# Altium schematic sheet 04-USB_POWER.SchDoc
size A3
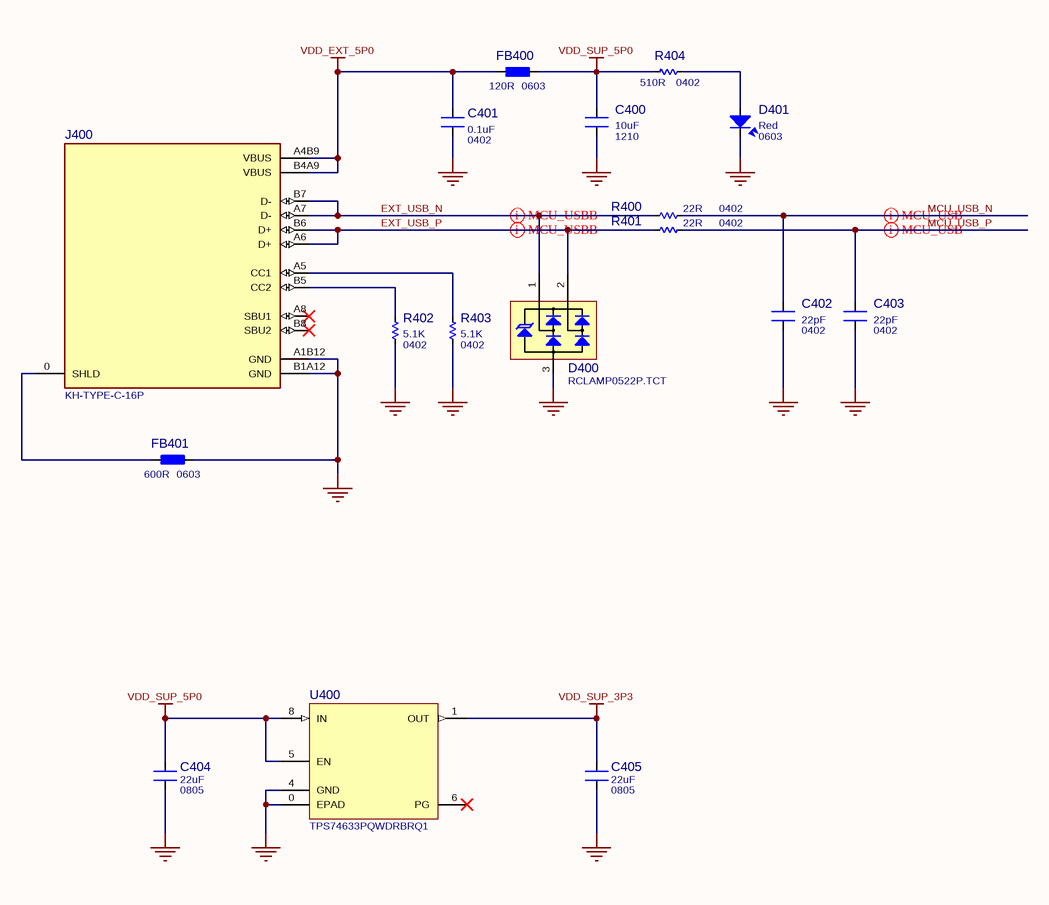
[diagram p0: 04-USB_POWER.SchDoc]

## Parts
C400  value 10uF  Package: 1210  [CAP_C_1210]  (hidden comment: Capacitor NP)
C401  value 0.1uF  Package: 0402  [CAP_C_0402]  (hidden comment: Capacitor NP)
C402  value 22pF  Package: 0402  [CAP_C_0402]  (hidden comment: Capacitor NP)
C403  value 22pF  Package: 0402  [CAP_C_0402]  (hidden comment: Capacitor NP)
C404  value 22uF  Package: 0805  [CAP_C_0805]  (hidden comment: Capacitor NP)
C405  value 22uF  Package: 0805  [CAP_C_0805]  (hidden comment: Capacitor NP)
D400  RCLAMP0522P.TCT  [SLP1610P4]
D401  Color: Red  Package: 0603  [LED-SMD-0603-RED]  (hidden comment: LED)
FB400  value 120R  Package: 0603  [IND_C_0603]  (hidden comment: Ferrite bead)
FB401  value 600R  Package: 0603  [IND_C_0603]  (hidden comment: Ferrite bead)
J400  Manufacturer Part Number: KH-TYPE-C-16P  [USB_C_F_16P_SMD]  (hidden comment: USB_C-16P)
R400  value 22R  Package: 0402  [RES_C_0402]  (hidden comment: Resistor)
R401  value 22R  Package: 0402  [RES_C_0402]  (hidden comment: Resistor)
R402  value 5.1K  Package: 0402  [RES_C_0402]  (hidden comment: Resistor)
R403  value 5.1K  Package: 0402  [RES_C_0402]  (hidden comment: Resistor)
R404  value 510R  Package: 0402  [RES_C_0402]  (hidden comment: Resistor)
U400  TPS74633PQWDRBRQ1  [SON65P300X100_HS-9N]

## Nets
GND: C400.1 C401.1 C402.2 C403.2 C404.1 C405.1 D400.3(GND) D401.2 FB401.1 J400.A1B12(GND) J400.B1A12(GND) R402.2 R403.2 U400.0(EPAD) U400.4(GND)
VDD_EXT_5P0: C401.2 FB400.2 J400.A4B9(VBUS) J400.B4A9(VBUS)
VDD_SUP_3P3: C405.2 U400.1(OUT)
VDD_SUP_5P0: C400.2 C404.2 FB400.1 R404.1 U400.5(EN) U400.8(IN)
EXT_USB_N: D400.1(DM) J400.A7(D-) J400.B7(D-) R400.1
EXT_USB_P: D400.2(DP) J400.A6(D+) J400.B6(D+) R401.1
MCU_USB_N: C402.1 R400.2
MCU_USB_P: C403.1 R401.2
NetD401_1: D401.1 R404.2
NetFB401_2: FB401.2 J400.0(SHLD)
NetJ400_A5: J400.A5(CC1) R403.1
NetJ400_B5: J400.B5(CC2) R402.1

Not connected (* = marked no-connect by the designer): J400 A8(SBU1)* B8(SBU2)*; U400 6(PG)*

## Layout directives
differential pair; net class NC_DIFFPAIR_90R_USB; differential pair class DIFFPAIR_90R_USB: EXT_USB_N, EXT_USB_P, MCU_USB_N, MCU_USB_P

## Library data of the parts
C400 = Cap: Ceramic Capacitor SMD 1210 10uF ±10% 25V; Manufacturer: Samsung; Manufacturer Part Number: CL32B106KAJNNNE; Temperature Coeffcient: -55 to 85℃; Revision: 0; Tolerance: ±10%; ComponentLink1URL: http://product.samsungsem.com/mlcc/CL05A105KA5NQN.do; ComponentLink1Description: SVN Datasheet; ComponentLink2URL: *; ComponentLink2Description: Local Datasheet; ComponentLink3URL: D:\Altium\Library\AS50 library\AS50.SchLib; ComponentLink3Description: Open Symbol; ComponentLink4URL: D:\Altium\Library\AS50 library\Capacitors.PcbLib; ComponentLink4Description: Open Footprint; ComponentLink5Description: Open Footprint 2; ComponentLink6Description: Open Footprint 3; ComponentLink7Description: Open Footprint 4; Category: Capacitor; Voltage: 25V; Supplier 1: LCSC; Supplier Part Number 1: C39232
C401 = Cap: Ceramic Capacitor SMD 0402 100nF ±10% 16V; Manufacturer: Samsung; Manufacturer Part Number: CL05B104KO5NNNC; Temperature Coeffcient: -55 to 85℃; Revision: 0; Tolerance: ±10%; ComponentLink1URL: http://product.samsungsem.com/mlcc/CL05B104KO5NNN.do; ComponentLink1Description: SVN Datasheet; ComponentLink2URL: *; ComponentLink2Description: Local Datasheet; ComponentLink3URL: D:\Altium\Library\AS50 library\AS50.SchLib; ComponentLink3Description: Open Symbol; ComponentLink4URL: D:\Altium\Library\AS50 library\Capacitors.PcbLib; ComponentLink4Description: Open Footprint; ComponentLink5Description: Open Footprint 2; ComponentLink6Description: Open Footprint 3; ComponentLink7Description: Open Footprint 4; Category: Capacitor; Voltage: 16V; Supplier 1: LCSC; Supplier Part Number 1: C1525
C402 C403 = Cap: Ceramic Capacitor SMD 0402 22pF ±5% 50V; Manufacturer: FH(Guangdong Fenghua Advanced Tech); Manufacturer Part Number: 0402CG220J500NT; Temperature Coeffcient: -55 to 85℃; Revision: 0; Tolerance: ±5%; ComponentLink1URL: https://datasheet.lcsc.com/lcsc/1810111610_FH-Guangdong-Fenghua-Advanced-Tech-0402CG150J500NT_C1548.pdf; ComponentLink1Description: SVN Datasheet; ComponentLink2URL: *; ComponentLink2Description: Local Datasheet; ComponentLink3URL: D:\Altium\Library\AS50 library\AS50.SchLib; ComponentLink3Description: Open Symbol; ComponentLink4URL: D:\Altium\Library\AS50 library\Capacitors.PcbLib; ComponentLink4Description: Open Footprint; ComponentLink5Description: Open Footprint 2; ComponentLink6Description: Open Footprint 3; ComponentLink7Description: Open Footprint 4; Category: Capacitor; Voltage: 50V; Supplier 1: LCSC; Supplier Part Number 1: C1555
C404 C405 = Cap: Ceramic Capacitor SMD 0805 22uF ±20% 10V; Manufacturer: Samsung; Manufacturer Part Number: CL21A226MPQNNNE; Temperature Coeffcient: -55 to 85℃; Revision: 0; Tolerance: ±20%; ComponentLink1URL: http://product.samsungsem.com/mlcc/CL21A226MPQNNN.do; ComponentLink1Description: SVN Datasheet; ComponentLink2URL: *; ComponentLink2Description: Local Datasheet; ComponentLink3URL: D:\Altium\Library\AS50 library\AS50.SchLib; ComponentLink3Description: Open Symbol; ComponentLink4URL: D:\Altium\Library\AS50 library\Capacitors.PcbLib; ComponentLink4Description: Open Footprint; ComponentLink5Description: Open Footprint 2; ComponentLink6Description: Open Footprint 3; ComponentLink7Description: Open Footprint 4; Category: Capacitor; Voltage: 10V; Supplier 1: LCSC; Supplier Part Number 1: C29277
D400 = RCLAMP0522P.TCT: 15V Clamp 5A (8/20µs) Ipp TVS Diode Surface Mount SLP1610P4; Manufacturer: Semtech; Supplier 1: LCSC; Manufacturer Part Number: RCLAMP0522P.TCT; Category: Diodes; ComponentLink1URL: https://semtech.my.salesforce.com/sfc/p/#E0000000JelG/a/440000001MK2/k1amoKEAHshbxcc58ZeFJEDBUGCuP_6DIpLB6XG33.E; ComponentLink1Description: SVD Datasheet; ComponentLink2URL: *; ComponentLink2Description: Local Datasheet; ComponentLink3URL: D:\Altium\Library\AS50 library\AS50.SchLib; ComponentLink3Description: Open Symbol; Supplier Part Number 1: C112169; ComponentLink4Description: Open Footprint; ComponentLink4URL: D:\Altium\Library\AS50 library\Diodes.PcbLib
D401 = LED: Red 615~630nm 1.9~2.2V 0603 Light Emitting Diodes (LED) RoHS; Manufacturer: Hubei KENTO Elec; Manufacturer Part Number: KT-0603R; Category: LEDs; ComponentLink1URL: http://www.led-kento.com/smd-led/0603-smd-led/0603-smd-led-emitting-color-red.html; ComponentLink1Description: SVD Datasheet; ComponentLink2URL: *; ComponentLink2Description: Local Datasheet; ComponentLink3URL: D:\Altium\Library\AS50 library\AS50.SchLib; ComponentLink3Description: Open Symbol; ComponentLink4URL: D:\Altium\Library\AS50 library\LED.PcbLib; ComponentLink4Description: Open Footprint; Supplier 1: LCSC; Supplier Part Number 1: C2286
FB400 = Ferrite bead: Ferrite bead SMD 0603 120Ω ±25% @ 100MHz DCR=0.03Ω 3A; Manufacturer: Murata Electronics; Manufacturer Part Number: BLM18KG121TH1D; Category: Ferrite Bead; Tolerance: 25%; Frequency: 100MHz; DC Current: 3A; ComponentLink1URL: https://www.sunlordinc.com/Download.aspx?file=L1VwbG9hZEZpbGVzL1BERl9DYXQvMjAyMTA5MDcxNDU1NTM2OC5wZGY=&lan=en; ComponentLink1Description: SVN Datasheet; ComponentLink2URL: *; ComponentLink2Description: Local Datasheet; ComponentLink3URL: D:\Altium\Library\AS50 library\AS50.SchLib; ComponentLink3Description: Open Symbol; ComponentLink4URL: D:\Altium\Library\AS50 library\Inductors.PcbLib; ComponentLink4Description: Open Footprint; Supplier 1: LCSC; Supplier Part Number 1: C437404
FB401 = Ferrite bead: Ferrite bead SMD 0603 600Ω ±25% @ 100MHz DCR=0.15Ω 1.3A; Manufacturer: Murata Electronics; Manufacturer Part Number: BLM18KG601SN1D; Category: Ferrite Bead; Tolerance: 25%; Frequency: 100MHz; DC Current: 1.3A; ComponentLink1URL: https://www.sunlordinc.com/Download.aspx?file=L1VwbG9hZEZpbGVzL1BERl9DYXQvMjAyMTA5MDcxNDU1NTM2OC5wZGY=&lan=en; ComponentLink1Description: SVN Datasheet; ComponentLink2URL: *; ComponentLink2Description: Local Datasheet; ComponentLink3URL: D:\Altium\Library\AS50 library\AS50.SchLib; ComponentLink3Description: Open Symbol; ComponentLink4URL: D:\Altium\Library\AS50 library\Inductors.PcbLib; ComponentLink4Description: Open Footprint; Supplier 1: LCSC; Supplier Part Number 1: C85833
J400 = USB_C-16P: 3A 16-pin Female -40℃~+85℃ Type-C SMD USB Connectors; Manufacturer: Shenzhen Kinghelm Elec; Category: Connectors; Supplier 1: LCSC; Supplier Part Number 1: C709357; ComponentLink1Description: SVD Datasheet; ComponentLink1URL: https://datasheet.lcsc.com/lcsc/2009111434_Shenzhen-Kinghelm-Elec-KH-TYPE-C-16P_C709357.pdf; ComponentLink2Description: Local Datasheet; ComponentLink2URL: *; ComponentLink3Description: Open Symbol; ComponentLink3URL: D:\Altium\Library\AS50 library\AS50.SchLib; ComponentLink4Description: Open Footprint; ComponentLink4URL: D:\Altium\Library\AS50 library\Connectors.PcbLib
R400 R401 = Res: Resistor SMD 0402 22R ±1% 1/16W; Manufacturer: UNI-ROYAL(Uniroyal Elec); Manufacturer Part Number: 0402WGF220JTCE; Voltage: 50V; Temperature Coeffcient: ±100ppm/C; Tolerance: ±1%; Revision: 0; ComponentLink1URL: http://uni-royal.cn/images/userfile/file/1590821906c56505e6d9ab55c7.pdf; ComponentLink1Description: SVN Datasheet; ComponentLink2URL: *; ComponentLink2Description: Local Datasheet; ComponentLink3URL: D:\Altium\Library\AS50 library\AS50.SchLib; ComponentLink3Description: Open Symbol; ComponentLink4URL: D:\Altium\Library\AS50 library\Resistors.PcbLib; ComponentLink4Description: Open Footprint; ComponentLink5Description: Open Footprint 2; ComponentLink6Description: Open Footprint 3; ComponentLink7Description: Open Footprint 4; Operating Temperature: -55C to +155C; Category: Resistor; Power: 1/16W; Supplier 1: LCSC; Supplier Part Number 1: C25092
R402 R403 = Res: Resistor SMD 0402 5.1K ±1% 1/16W; Manufacturer: UNI-ROYAL(Uniroyal Elec); Manufacturer Part Number: 0402WGF5101TCE; Voltage: 50V; Temperature Coeffcient: ±100ppm/C; Tolerance: ±1%; Revision: 0; ComponentLink1URL: http://uni-royal.cn/images/userfile/file/1590821906c56505e6d9ab55c7.pdf; ComponentLink1Description: SVN Datasheet; ComponentLink2URL: *; ComponentLink2Description: Local Datasheet; ComponentLink3URL: D:\Altium\Library\AS50 library\AS50.SchLib; ComponentLink3Description: Open Symbol; ComponentLink4URL: D:\Altium\Library\AS50 library\Resistors.PcbLib; ComponentLink4Description: Open Footprint; ComponentLink5Description: Open Footprint 2; ComponentLink6Description: Open Footprint 3; ComponentLink7Description: Open Footprint 4; Operating Temperature: -55C to +155C; Category: Resistor; Power: 1/16W; Supplier 1: LCSC; Supplier Part Number 1: C25905
R404 = Res: Resistor SMD 0402 510R ±1% 1/16W; Manufacturer: Yageo; Manufacturer Part Number: RC0402JR-07510RL; Voltage: 50V; Temperature Coeffcient: ±100ppm/C; Tolerance: ±1%; Revision: 0; ComponentLink1URL: https://www.yageo.com/upload/media/product/products/datasheet/rchip/PYu-RC_Group_51_RoHS_L_12.pdf; ComponentLink1Description: SVN Datasheet; ComponentLink2URL: *; ComponentLink2Description: Local Datasheet; ComponentLink3URL: D:\Altium\Library\AS50 library\AS50.SchLib; ComponentLink3Description: Open Symbol; ComponentLink4URL: D:\Altium\Library\AS50 library\Resistors.PcbLib; ComponentLink4Description: Open Footprint; ComponentLink5Description: Open Footprint 2; ComponentLink6Description: Open Footprint 3; ComponentLink7Description: Open Footprint 4; Operating Temperature: -55C to +155C; Category: Resistor; Power: 1/16W; Supplier 1: LCSC; Supplier Part Number 1: C137860
U400 = TPS746xxPQWDRBRQ1: Texas Instruments TPS746-Q1 Automotive, 1-A LDO With Power-Good in Small Wettable Flank WSON / Packages; Category: ICs; Manufacturer: Texas Instruments; Manufacturer Part Number: TPS74633PQWDRBRQ1; Supplier 1: Digikey; Supplier Part Number 1: 296-TPS74633PQWDRBRQ1CT-ND; ComponentLink1Description: SVD Datasheet; ComponentLink1URL: https://www.ti.com/lit/ds/symlink/tps746-q1.pdf; ComponentLink2Description: Local Datasheet; ComponentLink2URL: *; ComponentLink3Description: Open Symbol; ComponentLink3URL: D:\Altium\Library\AS50 library\AS50.SchLib; ComponentLink4Description: Open Footprint; ComponentLink4URL: D:\Altium\Library\AS50 library\IC.PcbLib